# Altium schematic sheet Keo_truot_cua_tu_6_sensor_2_Schematic.SchDoc
size A3
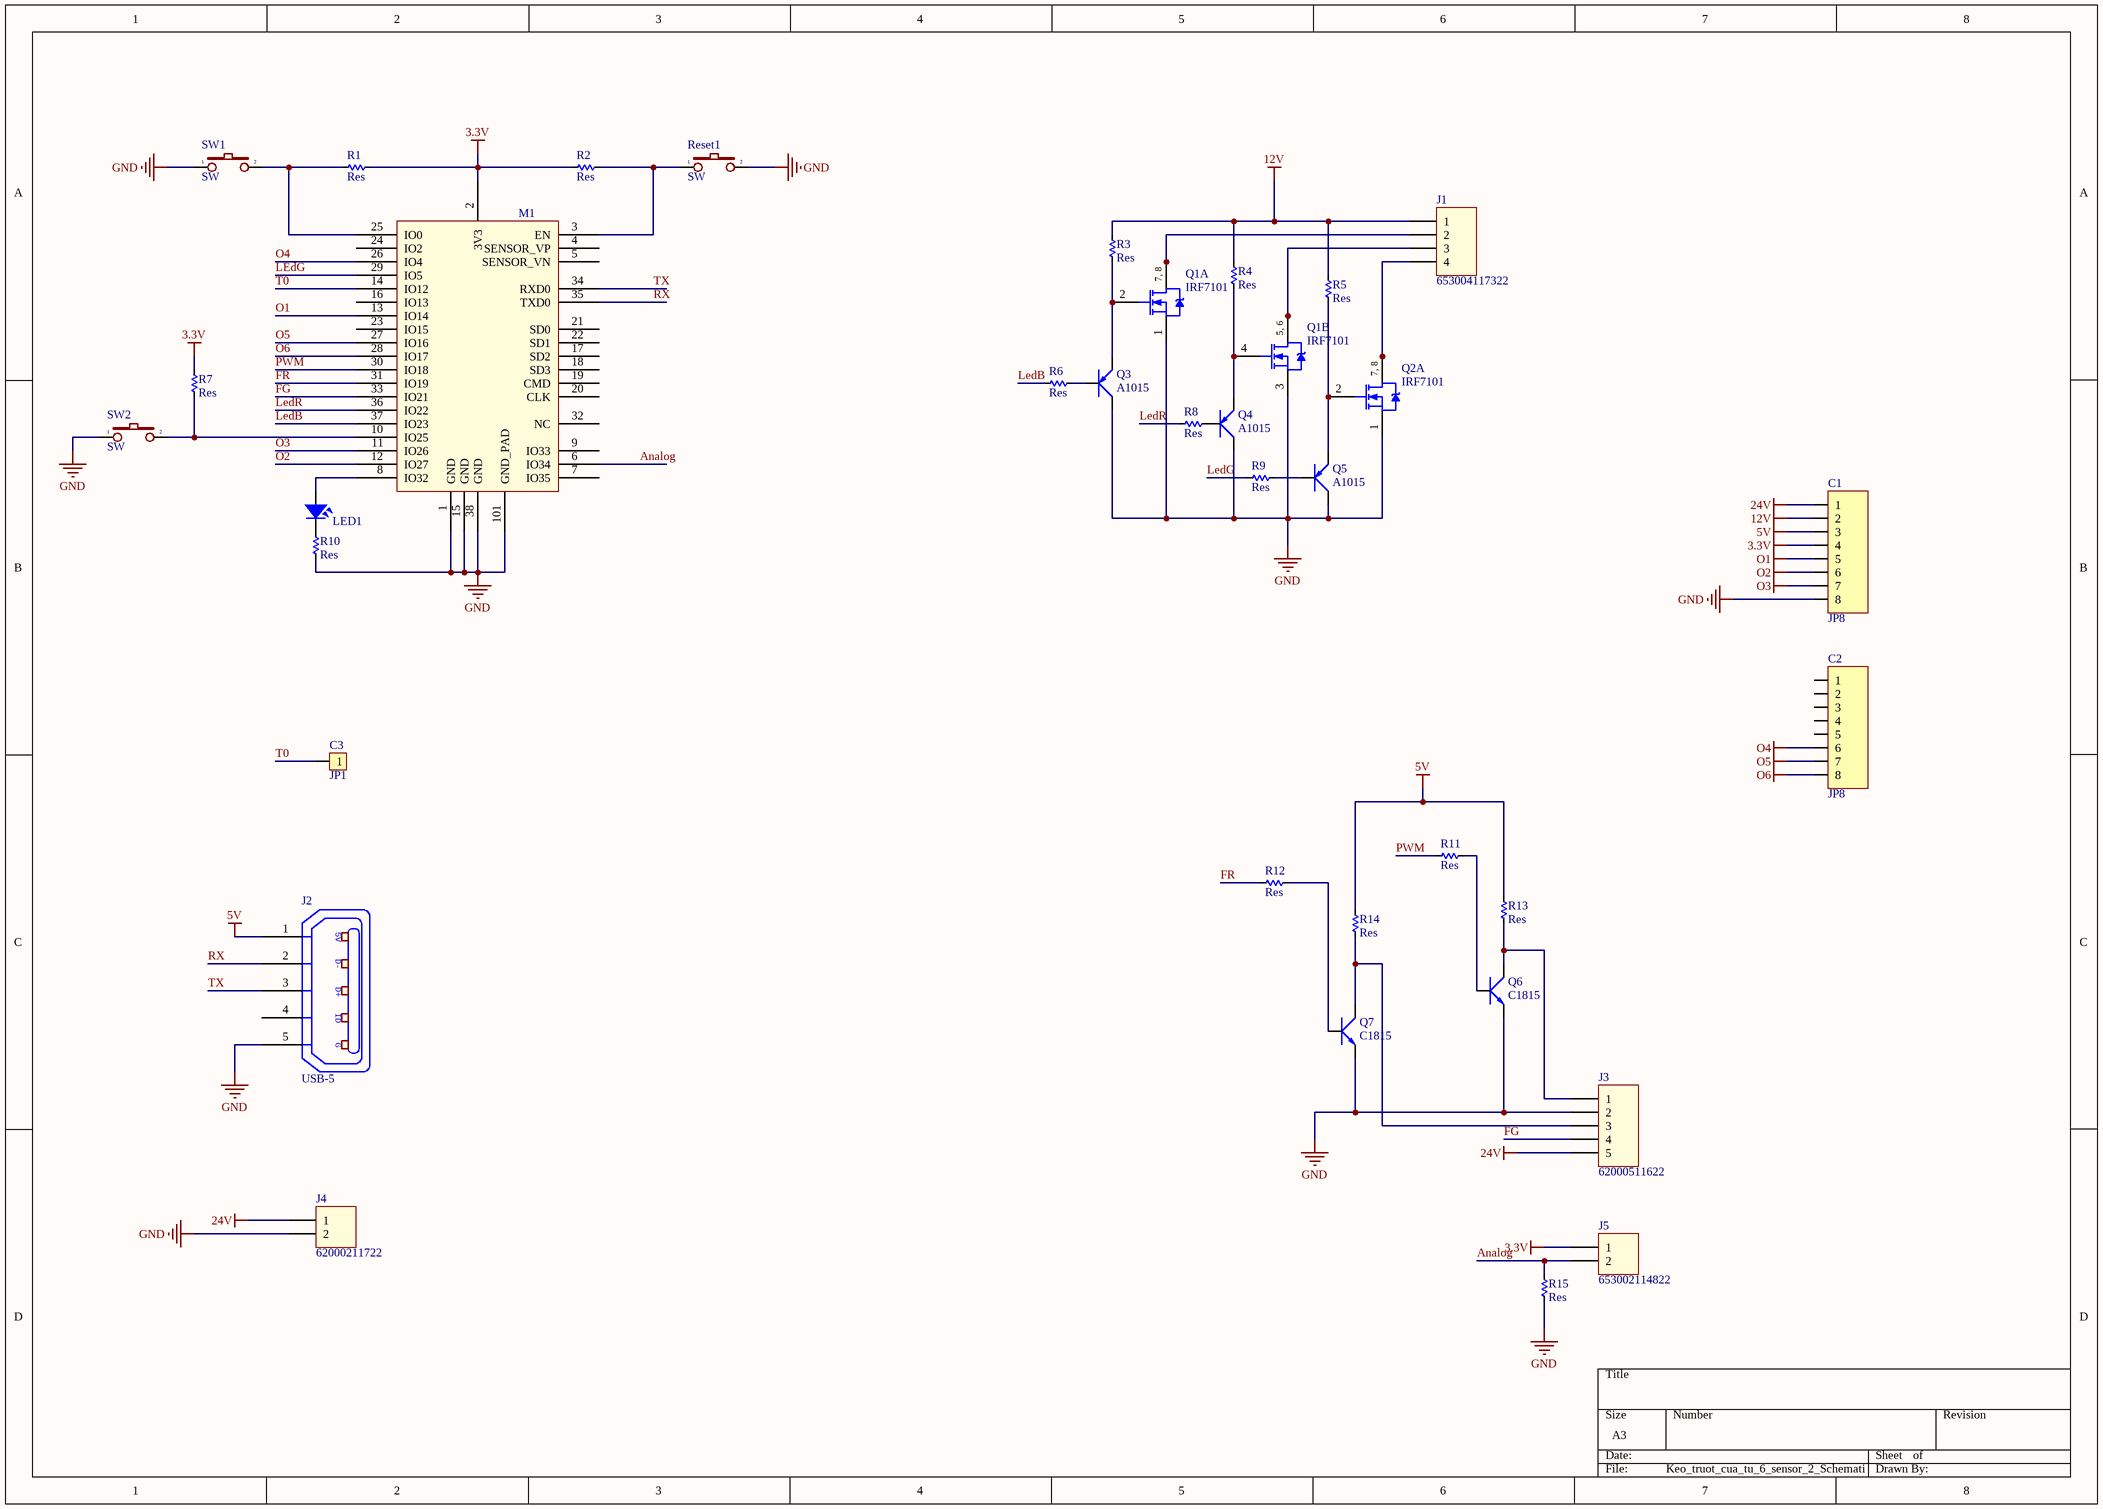
[diagram p0: Keo_truot_cua_tu_6_sensor_2_Schematic.SchDoc]

## Parts
C1  JP8  [JP8-D1T]
C2  JP8  [JP8-D1T]
C3  JP1  [JP1-D1T]
J1  653004117322  [653004117322]
J2  USB-5  [USB-M1]
J3  62000511622  [62000511622]
J4  62000211722  [62000211722]
J5  653002114822  [653002114822]
LED1  LED  [LED-0805-Blue]  (value not drawn)
M1  ESP32S_Module  [ESP32S]  (value not drawn)
Q1  IRF7101  [SO-8_N]  (parts A,B of 2)
Q2  IRF7101  [SO-8_N]  (part A of 2)
Q3  A1015  [SOT23B]
Q4  A1015  [SOT23B]
Q5  A1015  [SOT23B]
Q6  C1815  [SOT23B]
Q7  C1815  [SOT23B]
R1  Res  [RES-SMD-0805]
R2  Res  [RES-SMD-0805]
R3  Res  [RES-SMD-0805]
R4  Res  [RES-SMD-0805]
R5  Res  [RES-SMD-0805]
R6  Res  [RES-SMD-0805]
R7  Res  [RES-SMD-0805]
R8  Res  [RES-SMD-0805]
R9  Res  [RES-SMD-0805]
R10  Res  [RES-SMD-0805]
R11  Res  [RES-SMD-0805]
R12  Res  [RES-SMD-0805]
R13  Res  [RES-SMD-0805]
R14  Res  [RES-SMD-0805]
R15  Res  [RES-SMD-0805]
Reset1  SW  [SW1-SMD]
SW1  SW  [SW-DIP1-1]
SW2  SW  [SW1-DIP]

## Nets
3.3V: C1.4 J5.1 M1.2(3V3) R1.1 R2.2 R7.1
5V: C1.3 J2.1(P1) R13.2 R14.2
12V: C1.2 J1.1 R3.1 R4.1 R5.1
24V: C1.1 J3.5 J4.1
GND: C1.8 J2.5(P5) J3.2 J4.2 M1.1(GND) M1.15(GND) M1.38(GND) M1.101(GND_PAD) Q1.1(S) Q1.3(S) Q2.1(S) Q3.2(C) Q4.2(C) Q5.2(C) Q6.1(E) Q7.1(E) R10.2 R15.1 Reset1.2 SW1.1 SW2.1
O1: C1.5 M1.13(IO14)
O2: C1.6 M1.12(IO27)
O3: C1.7 M1.11(IO26)
O4: C2.6 M1.26(IO4)
O5: C2.7 M1.27(IO16)
O6: C2.8 M1.28(IO17)
Analog: J5.2 M1.6(IO34) R15.2
FG: J3.4 M1.33(IO21)
FR: M1.31(IO19) R12.1
LedB: M1.37(IO23) R6.1
LedG: M1.29(IO5) R9.1
LedR: M1.36(IO22) R8.1
PWM: M1.30(IO18) R11.1
RX: J2.2(P2) M1.35(TXD0)
T0: C3.1 M1.14(IO12)
TX: J2.3(P3) M1.34(RXD0)
NetJ1_2: J1.2 Q1.7(D) Q1.8(D)
NetJ1_3: J1.3 Q1.5(D) Q1.6(D)
NetJ1_4: J1.4 Q2.7(D) Q2.8(D)
NetJ3_1: J3.1 Q6.2(C) R13.1
NetJ3_3: J3.3 Q7.2(C) R14.1
NetLED1_1: LED1.1 M1.8(IO32)
NetLED1_2: LED1.2 R10.1
NetM1_3: M1.3(EN) R2.1 Reset1.1
NetM1_10: M1.10(IO25) R7.2 SW2.2
NetM1_25: M1.25(IO0) R1.2 SW1.2
NetQ1_2: Q1.2(G) Q3.1(E) R3.2
NetQ1_4: Q1.4(G) Q4.1(E) R4.2
NetQ2_2: Q2.2(G) Q5.1(E) R5.2
NetQ3_3: Q3.3(B) R6.2
NetQ4_3: Q4.3(B) R8.2
NetQ5_3: Q5.3(B) R9.2
NetQ6_3: Q6.3(B) R11.2
NetQ7_3: Q7.3(B) R12.2

Not connected (* = marked no-connect by the designer): C2 1 2 3 4 5; J2 4(P4); M1 4(SENSOR_VP) 5(SENSOR_VN) 7(IO35) 9(IO33) 16(IO13) 17(SD2) 18(SD3) 19(CMD) 20(CLK) 21(SD0) 22(SD1) 23(IO15) 24(IO2) 32(NC)

## Notes on the sheet
- (in symbol IRF7101, part A) 7, 8
- (in symbol IRF7101, part B) 5, 6
- (in symbol USB-5) 5V; D-; D+; ID; G

## Library data of the parts
C1 C2 = JP8: WR-PHD 2.54 mm Angled Socket Header; Manufacturer: W¨¹rth Elektronik eiSos GmbH; partNo: 613008143121; ComponentLink1 Description: Manufacturer; ComponentLink2 Description: Datasheet; NoPins: 08; Created Date: 29 March 2013; ComponentLink1URL: http://www.we-online.com; ComponentLink2URL: http://katalog.we-online.de/em/datasheet/6130xx143121.pdf; Created by: Karrer Zheng
C3 = JP1: WR-PHD 2.54 mm Angled Socket Header; Manufacturer: W¨¹rth Elektronik eiSos GmbH; partNo: 613002143121; ComponentLink1 Description: Manufacturer; ComponentLink2 Description: Datasheet; NoPins: 02; Created Date: 29 March 2013; ComponentLink1URL: http://www.we-online.com; ComponentLink2URL: http://katalog.we-online.de/em/datasheet/6130xx143121.pdf; Created by: Karrer Zheng
J1 = 653004117322: WR-WTB 1.25mm Male Horizontal Shrouded Header, 4p; Pin Number: 4; ComponentLink1Description: Manufacturer; ComponentLink1URL: http://www.we-online.de; ComponentLink2Description: Datasheet; ComponentLink2URL: http://katalog.we-online.de/em/datasheet/6530xx117322.pdf; Part Number: 653004117322; Published Date: June 2017; Publisher: Wurth Elektronik; Pitch: 1.25 mm
J2 = USB-5: Manufacturer: FCI; Manufacturer Part Number: 10118193-0001LF; Connector Type: USB - micro B; Number of Contacts: 5; Gender: Receptacle; Specifications: USB 2.0; .Creator: MM; .Checked PCB: RF; Supplier 1: Digi-Key; RoHS: RoHS Compliant; Category: Connectors, Interconnects; Stock 1: 28642; Pricing 1: 1=0.46, 10=0.433, 25=0.3712, 50=0.3156, 100=0.3032, 250=0.27224, 500=0.25988 (USD); Packaging: Cut Tape (CT); Mounting Type: Surface Mount, Right Angle, Horizontal; Features: Shielded, Solder Retention; Ingress Protection: -; ComponentLink1URL: http://portal.fciconnect.com/Comergent//fci/drawing/10118193.pdf; ComponentLink1Description: http://portal.fciconnect.com/Comergent//fci/drawing/10118193.pdf; Supplier Part Number 1: 609-4616-1-ND; .Checked SCH: MM
J3 = 62000511622: WR-WTB 2.00mm Male Vertical Shrouded Header, 5p; Pin Number: 5; ComponentLink1Description: Manufacturer; ComponentLink1URL: http://www.we-online.de; ComponentLink2Description: Datasheet; ComponentLink2URL: http://katalog.we-online.de/em/datasheet/6200xx11622.pdf; Part Number: 62000511622; Published Date: June 2017; Publisher: Wurth Elektronik; Pitch: 2.00 mm
J4 = 62000211722: WR-WTB 2.00mm Male Horizontal Shrouded Header, 2p; Pin Number: 2; ComponentLink1Description: Manufacturer; ComponentLink1URL: http://www.we-online.de; ComponentLink2Description: Datasheet; ComponentLink2URL: http://katalog.we-online.de/em/datasheet/6200xx11722.pdf; Part Number: 62000211722; Published Date: June 2017; Publisher: Wurth Elektronik; Pitch: 2.00 mm
J5 = 653002114822: WR-WTB 1.25mm Male Vertical Shrouded Header, 2p; Pin Number: 2; ComponentLink1Description: Manufacturer; ComponentLink1URL: http://www.we-online.de; ComponentLink2Description: Datasheet; ComponentLink2URL: http://katalog.we-online.de/em/datasheet/6530xx114822.pdf; Part Number: 653002114822; Published Date: June 2017; Publisher: Wurth Elektronik; Pitch: 1.25 mm
LED1 = LED SMD: Value: LED 3 - 5 ly 2 Colour
M1 = ESP32S_Module: Esp-32S; Datasheet: https://espressif.com/sites/default/files/documentation/esp_wroom_32_datasheet_en.pdf
Q1 Q2 = IRF7101: HEXFET Power MOSFET; Published: 8-Jun-2000; LatestRevisionDate: 13-Apr-2006; LatestRevisionNote: IPC-7351 Footprint Added.; DatasheetVersion: Aug-1997; PackageVersion: Feb-2001; PackageReference: SO-8; Publisher: Altium Limited; PackageDescription: 8-Pin Plastic Small Outline Integrated Circuit 1.27 mm Pitch; Code_JEDEC: MS-012-AA; Code_IPC: SOIC127P600-8; ComponentLink1Description: Manufacturer Link; ComponentLink1URL: http://www.irf.com/; ComponentLink2Description: Datasheet; ComponentLink2URL: http://www.irf.com/product-info/datasheets/data/irf7101.pdf
Q3-Q5 = A1015: PNP 600mW, ECB; Value: A1015
Q6 Q7 = C1815: NPN 600mW, ECB; Value: C1815
R1-R15 = Res-SMD: Resistor; Manufacturer: Generic Components; Class: Passive; Published: 08/06/2000; Publisher: Altium Hobart Technology Centre
Reset1 SW1 SW2 = SW2: Switch button 2 pin; Value: SW chip 2 pin